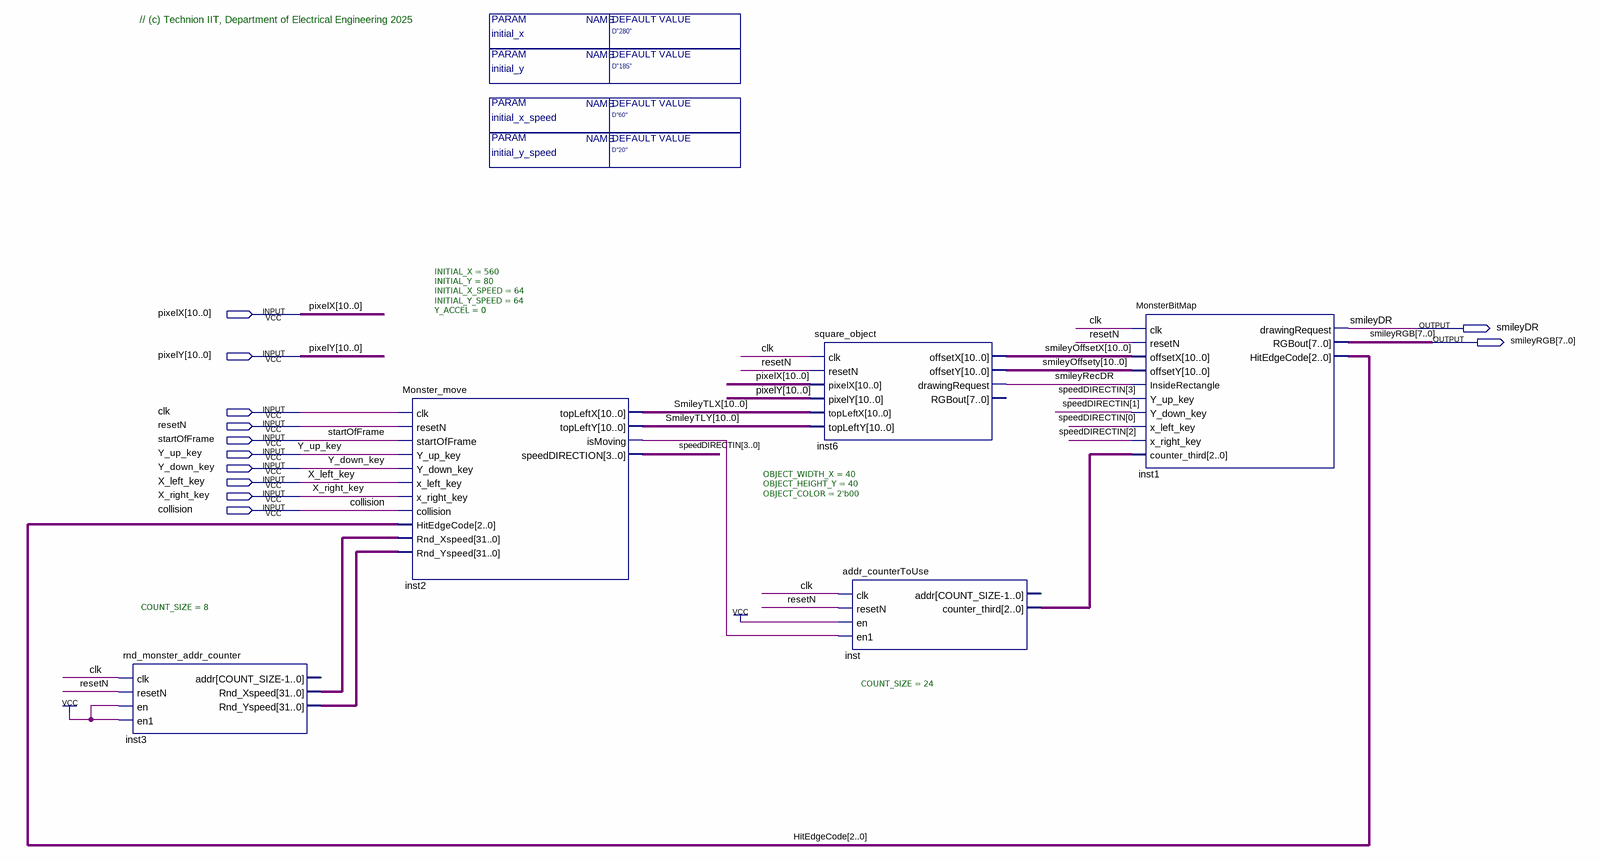
[diagram p0: schematic sheet]
// Quartus schematic Monster_Block_T.bdf as structural Verilog: 5 symbols, 12 pins
module Monster_Block_T #(parameter initial_x = "D\"280\"", parameter initial_y = "D\"185\"", parameter initial_x_speed = "D\"60\"", parameter initial_y_speed = "D\"20\"") (
  input  [10:0] pixelX,
  input  [10:0] pixelY,
  input  clk,
  input  resetN,
  input  startOfFrame,
  input  Y_up_key,
  input  Y_down_key,
  input  X_left_key,
  input  X_right_key,
  input  collision,
  output smileyDR,
  output [7:0] smileyRGB
);

  wire inst2_ismoving, smileyRecDR;
  wire [2:0] HitEdgeCode, inst_counter_third;
  wire [3:0] speedDIRECTIN;
  wire [10:0] smileyOffsetX, smileyOffsety, SmileyTLX, SmileyTLY;
  wire [31:0] inst3_rnd_xspeed, inst3_rnd_yspeed;

  rnd_monster_addr_counter #(.COUNT_SIZE(8)) inst3 (
    .clk(clk), .resetN(resetN), .en(1'b1), .en1(1'b1), .Rnd_Xspeed(inst3_rnd_xspeed),
    .Rnd_Yspeed(inst3_rnd_yspeed));  // open: addr
  Monster_move #(.INITIAL_X(560), .INITIAL_Y(80), .INITIAL_X_SPEED(64), .INITIAL_Y_SPEED(64), .Y_ACCEL(0)) inst2 (
    .clk(clk), .resetN(resetN), .startOfFrame(startOfFrame), .Y_up_key(Y_up_key), .Y_down_key(Y_down_key),
    .x_left_key(X_left_key), .x_right_key(X_right_key), .collision(collision), .HitEdgeCode(HitEdgeCode),
    .Rnd_Xspeed(inst3_rnd_xspeed), .Rnd_Yspeed(inst3_rnd_yspeed), .topLeftX(SmileyTLX), .topLeftY(SmileyTLY),
    .isMoving(inst2_ismoving), .speedDIRECTION(speedDIRECTIN));
  square_object #(.OBJECT_WIDTH_X(40), .OBJECT_HEIGHT_Y(40), .OBJECT_COLOR(2'b00)) inst6 (
    .clk(clk), .resetN(resetN), .pixelX(pixelX), .pixelY(pixelY), .topLeftX(SmileyTLX), .topLeftY(SmileyTLY),
    .offsetX(smileyOffsetX), .offsetY(smileyOffsety), .drawingRequest(smileyRecDR));  // open: RGBout
  addr_counterToUse #(.COUNT_SIZE(24)) inst (
    .clk(clk), .resetN(resetN), .en(1'b1), .en1(inst2_ismoving), .counter_third(inst_counter_third));  // open: addr
  MonsterBitMap inst1 (
    .clk(clk), .resetN(resetN), .offsetX(smileyOffsetX), .offsetY(smileyOffsety),
    .InsideRectangle(smileyRecDR), .Y_up_key(speedDIRECTIN[3]), .Y_down_key(speedDIRECTIN[1]),
    .x_left_key(speedDIRECTIN[0]), .x_right_key(speedDIRECTIN[2]), .counter_third(inst_counter_third),
    .drawingRequest(smileyDR), .RGBout(smileyRGB), .HitEdgeCode(HitEdgeCode));

  // Notes on the sheet:
  //   // (c) Technion IIT, Department of Electrical Engineering 2025
endmodule
